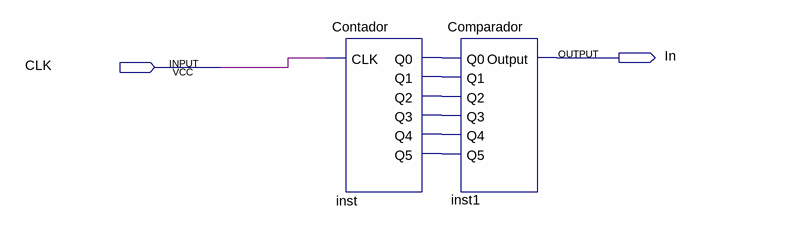
[diagram p0: schematic sheet]
// Quartus schematic ComparadorContador.bdf as structural Verilog: 2 symbols, 2 pins
module ComparadorContador (
  input  CLK,
  output In
);

  wire inst_q0, inst_q1, inst_q2, inst_q3, inst_q4, inst_q5;

  Contador inst (.CLK(CLK), .Q0(inst_q0), .Q1(inst_q1), .Q2(inst_q2), .Q3(inst_q3), .Q4(inst_q4), .Q5(inst_q5));
  Comparador inst1 (.Q0(inst_q0), .Q1(inst_q1), .Q2(inst_q2), .Q3(inst_q3), .Q4(inst_q4), .Q5(inst_q5), .Output(In));
endmodule
